# Altium schematic sheet Optical_TX.SchDoc
size A4; CompanyName: Technische Hochschule Nürnberg Georg Simon Ohm; Organization: UltraZohm; Address1: Kesslerplatz 12; Address2: 90489 Nürnberg; Address3: GERMANY; Website: www.ultrazohm.com
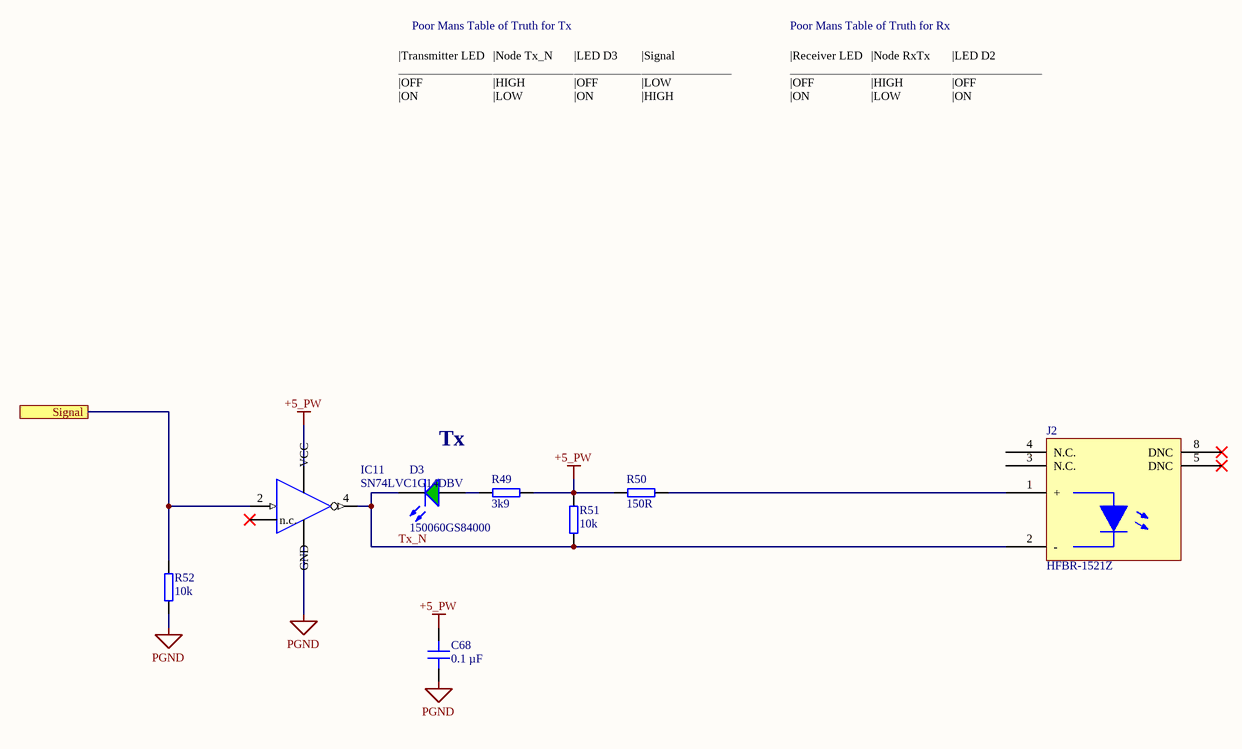
[diagram p0: Optical_TX.SchDoc]

## Parts
C68  0.1 µF  [C_0603]
D3  150060GS84000  [WL-SMCW_0603]
IC11  SN74LVC1G14DBV  [SOT23-5_L]
J2  HFBR-1521Z  [HFBRx5XX]
R49  3k9  [RES 0603_1608]
R50  150R  [RES 0603_1608]
R51  10k  [RES 0603_1608]
R52  10k  [RES 0603_1608]

## Ports
Signal

## Nets
+5_PW: C68.2 IC11.5(VCC) R49.2 R50.1 R51.2
PGND: C68.1 IC11.3(GND) R52.1
Signal: IC11.2(A) R52.2 ; port Signal
Tx_N: D3.1(K) IC11.4(~{Y}) J2.2(-) R51.1
NetD3_2: D3.2(A) R49.1
NetJ2_1: J2.1(+) R50.2

Not connected (* = marked no-connect by the designer): IC11 1(n.c.)*; J2 3(N.C.) 4(N.C.) 5(DNC)* 8(DNC)*

## Notes on the sheet
- Poor Mans Table of Truth for Tx
- Poor Mans Table of Truth for Rx
- |Transmitter LED
  _________________
  |OFF
  |ON
- |Node Tx_N
  _________________
  |HIGH
  |LOW
- |LED D3
  _______________
  |OFF
  |ON
- GATE
  _______
  LOW
  HIGH
- |Signal
  _______________
  |LOW
  |HIGH
- |Receiver LED
  ________________
  |OFF
  |ON
- |Node RxTx
  _________________
  |HIGH
  |LOW
- |LED D2
  _______________
  |OFF
  |ON
- Tx
- Title
- Revision:
- Design Engineer:
- Date:
- Project:
- Sheet
- of

## Library data of the parts
C68 = C0603X104K5RAC7411: Capacitor 0603, 50 VDC, 0.1 µF, X7R; Manufacturer: KEMET; Tolerance: 10 %; Voltage Rating: 50 VDC; Created from: MGremer; Manufacturer Part Number: C0603X104K5RAC7411; PartID: 3; Created On: 20.12.2020 13:54:13; ComponentLink1Description: Datasheet; ComponentLink1URL: https://www.mouser.de/datasheet/2/212/1/KEM_C1013_X7R_FT_CAP_SMD-1103280.pdf; Component Type: Capacitor 0603; Device Package: 0603; Last Updated: 04.03.2021 09:24:28; Mounting Type: SMD; Operating Temperature: -55 - 125°C; Series: SMD Comm X7R Flex; Supplier 1: Mouser; Supplier Part Number 1: 80-C0603X104K5R7411; Supplier 2: LCSC; Supplier Part Number 2: C14663; Type: Capacitor; Value: 0.1 µF; Live Cycle Status: 1; LCSC Part Number: C14663; Stock number: Labor SMD Container
D3 = 150060GS84000: WL-SMCW SMD Mono-color Chip LED Waterclear Green; Manufacturer: Wuerth Elektronik; Type: Standard; Created from: MGremer; Forward Current I_f: 20 mA; Forward Voltage U_f: 3.2 V; Wavelength: 525 nm; Light Intensity: 3000 mcd; Nominal Power: 78 mW; Manufacturer Part Number: 150060GS84000; PartID: 2; Created On: 08.12.2020 10:41:11; ComponentLink1Description: Datasheet; ComponentLink1URL: https://www.mouser.de/datasheet/2/445/150060GS75020-1714345.pdf; Component Type: LED Diode; Device Package: 0603; Last Updated: 03.03.2021 09:59:51; Mounting Type: SMD; Operating Temperature: -40 - 85 °C; Supplier 1: Mouser; Supplier Part Number 1: 710-150060GS84000; Supplier 2: Farnell; Supplier Part Number 2: 3408612; Supplier 3: Digi-Key; Supplier Part Number 3: 732-150060GS84000CT-ND; Live Cycle Status: 1; Stock number: not stored; Color: green
IC11 = SN74LVC1G14DBV: Inverting Schmitt trigger; Manufacturer: Texas Instruments; Value: 5.5 V; Created from: VStarost; Manufacturer Part Number: SN74LVC1G14DBV; PartID: 3; Created On: 13.12.2022 09:50:11; ComponentLink1Description: Datasheet; ComponentLink1URL: https://www.ti.com/lit/ds/symlink/sn74lvc1g14.pdf?HQS=dis-mous-null-mousermode-dsf-pf-null-wwe&ts=1670840401866&ref_url=https%253A%252F%252Fwww.mouser.de%252F; Component Type: Inverting Schmitt trigger; Device Package: SOT-23-5; Last Updated: 15.02.2023 18:15:19; Mounting Type: SMD; Operating Temperature: -40 - 125 °C; Series: SN74LVC1G14; Supplier 1: Mouser; Supplier Part Number 1: 595-SN74LVC1G14DBVT; Type: Schmitt trigger; Live Cycle Status: 1; Stock number: not stored; LCSC Part Number: C434069
J2 = HFBR-1521Z: Fibre Optic Transmitters, Link Horiz 5MBd Tx RoHS; Manufacturer: Broadcom; MF: Broadcom/Avago; Wavelength: 660 nm; Foreward Current: 60 mA; Supply Voltage: 5V; Created from: VStarost; Created: 2019_04_09_Kreppel; MPN: HFBR-1521Z; Data Rate: 5 MBd; Supplier 1: Mouser; Supplier Part Number 1: 630-HFBR-1521Z; Manufacturer Part Number: HFBR-1521Z; PartID: 2; Created On: 27.12.2022 10:35:16; ComponentLink1Description: Datasheet; ComponentLink1URL: https://datasheet.ciiva.com/19453/1584669-19453911.pdf?src-supplier=Jameco; Component Type: LWL Transmitter; Device Package: THT; Last Updated: 27.12.2022 10:35:16; Mounting Type: THT; Series: HFBR; Type: LWL Transmitter; Live Cycle Status: 1; Stock number: not stored
R49 = RK73B1JTTDD392J: SMD resistor E24 series; Manufacturer: KOA Speer; Tolerance: 5%; Created from: MGremer; Manufacturer Part Number: RK73B1JTTDD392J; PartID: 88; Created On: 14.12.2020 16:17:14; ComponentLink1Description: Datasheet; ComponentLink1URL: https://www.mouser.de/datasheet/2/219/RK73B-1825463.pdf; Component Type: SMD resistor; Device Package: 0603; Last Updated: 15.02.2023 17:47:58; Mounting Type: SMD; Supplier 1: Mouser; Supplier Part Number 1: 660-RK73B1JTTDD392J; Type: Resistor; Value: 3k9; Live Cycle Status: 1; Stock number: Labor SMD Container; LCSC Part Number: C177310
R50 = RK73B1JTTD151J: SMD resistor E24 series; Manufacturer: KOA Speer; Tolerance: 5%; Created from: MGremer; Manufacturer Part Number: RK73B1JTTD151J; PartID: 54; Created On: 14.12.2020 16:17:14; ComponentLink1Description: Datasheet; ComponentLink1URL: https://www.mouser.de/datasheet/2/219/RK73B-1825463.pdf; Component Type: SMD resistor; Device Package: 0603; Last Updated: 27.05.2022 13:41:55; Mounting Type: SMD; Supplier 1: Mouser; Supplier Part Number 1: 660-RK73B1JTTD151J; Type: Resistor; Value: 150R; Live Cycle Status: 1; Stock number: Labor SMD Container; LCSC Part Number: C22808
R51 R52 = RK73B1JTTD103J: SMD resistor E24 series; Manufacturer: KOA Speer; Tolerance: 5%; Created from: MGremer; Manufacturer Part Number: RK73B1JTTD103J; PartID: 98; Created On: 14.12.2020 16:17:14; ComponentLink1Description: Datasheet; ComponentLink1URL: https://www.mouser.de/datasheet/2/219/RK73B-1825463.pdf; Component Type: SMD resistor; Device Package: 0603; Last Updated: 27.05.2022 14:04:22; Mounting Type: SMD; Supplier 1: Mouser; Supplier Part Number 1: 660-RK73B1JTTD103J; Type: Resistor; Value: 10k; Live Cycle Status: 1; Stock number: Labor SMD Container; LCSC Part Number: C25804